# EAGLE design apollo18 (EAGLE 6.6.0)
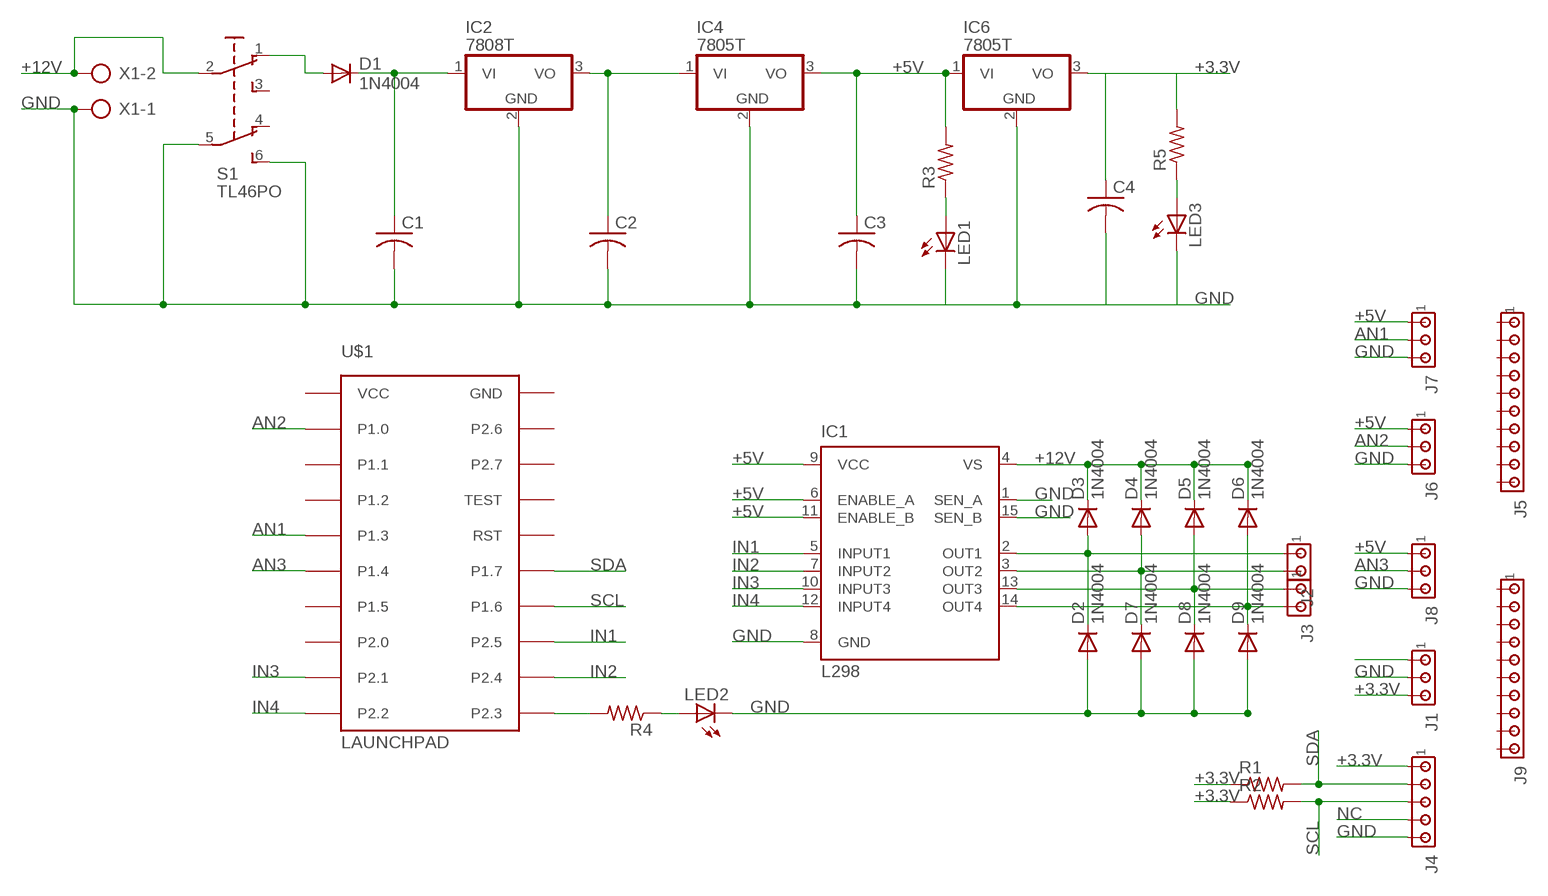
[diagram p0: schematic, sheet 1]

## Parts
C1  C-US025-050X050  [C025-050X050]
C2  C-US025-050X050  [C025-050X050]
C3  C-US025-050X050  [C025-050X050]
C4  C-US025-025X050  [C025-025X050]
D1  1N4004  [DO41-10]
D2  1N4004  [DO41-10]
D3  1N4004  [DO41-10]
D4  1N4004  [DO41-10]
D5  1N4004  [DO41-10]
D6  1N4004  [DO41-10]
D7  1N4004  [DO41-10]
D8  1N4004  [DO41-10]
D9  1N4004  [DO41-10]
IC1  L298  [MULTIWATT-15]
IC2  7808T  [TO220H]
IC4  7805T  [TO220H]
IC6  7805T  [TO220H]
J1  MTA03-100  [10X03MTA]
J2  MTA02-100  [10X02MTA]
J3  MTA02-100  [10X02MTA]
J4  MTA05-100  [10X05MTA]
J5  MTA10-100  [10X10MTA]
J6  MTA03-100  [10X03MTA]
J7  MTA03-100  [10X03MTA]
J8  MTA03-100  [10X03MTA]
J9  MTA10-100  [10X10MTA]
LED1  LED5MM  [LED5MM]
LED2  LED5MM  [LED5MM]
LED3  LED5MM  [LED5MM]
R1  R-US_0204/7  [0204/7]
R2  R-US_0204/7  [0204/7]
R3  R-US_0204/7  [0204/7]
R4  R-US_0204/7  [0204/7]
R5  R-US_0204/7  [0204/7]
S1  TL46PO  [TL4XPO]
U$1  LAUNCHPAD  [LAUNCHPAD]
X1  AK300/2  [AK300/2]

## Nets
+3.3V: C4.1 IC6.3(VO) J1.3 J4.1 R1.1 R2.1 R5.2
+5V: C3.1 IC1.6(ENABLE_A) IC1.9(VCC) IC1.11(ENABLE_B) IC4.3(VO) IC6.1(VI) J6.1 J7.1 J8.1 R3.2
+12V: D3.C D4.C D5.C D6.C IC1.4(VS) S1.2(P) X1.2
AN1: J7.2 U$1.P1.3
AN2: J6.2 U$1.P1.0
AN3: J8.2 U$1.P1.4
GND: C1.2 C2.2 C3.2 C4.2 D2.A D7.A D8.A D9.A IC1.1(SEN_A) IC1.8(GND) IC1.15(SEN_B) IC2.2(GND) IC4.2(GND) IC6.2(GND) J1.2 J4.5 J6.3 J7.3 J8.3 LED1.K(C) LED2.K(C) LED3.K(C) S1.5(P1) S1.6(S1) X1.1
IN1: IC1.5(INPUT1) U$1.P2.5
IN2: IC1.7(INPUT2) U$1.P2.4
IN3: IC1.10(INPUT3) U$1.P2.1
IN4: IC1.12(INPUT4) U$1.P2.2
N$1: J1.1
N$2: D2.C D3.A IC1.2(OUT1) J2.1
N$3: D4.A D7.C IC1.3(OUT2) J2.2
N$4: D5.A D8.C IC1.13(OUT3) J3.1
N$5: D6.A D9.C IC1.14(OUT4) J3.2
N$6: C1.1 D1.C IC2.1(VI)
N$7: D1.A S1.1(O)
N$8: C2.1 IC2.3(VO) IC4.1(VI)
N$9: LED3.A R5.1
N$11: LED1.A R3.1
N$12: R4.2 U$1.P2.3
N$13: LED2.A R4.1
NC: J4.4
SCL: J4.3 R2.2 U$1.P1.6
SDA: J4.2 R1.2 U$1.P1.7
Unconnected: J5.1 J5.2 J5.3 J5.4 J5.5 J5.6 J5.7 J5.8 J5.9 J5.10 J9.1 J9.2 J9.3 J9.4 J9.5 J9.6 J9.7 J9.8 J9.9 J9.10 S1.3(S) S1.4(O1) U$1.P1.1 U$1.P1.2 U$1.P1.5 U$1.P2.0 U$1.P2.6 U$1.P2.7 U$1.RST U$1.TEST

## Power pins joined to a net without a drawn wire
GND: U$1.GND
VCC: U$1.VCC

## Library data of the parts
C1-C4 = rcl:C-US: CAPACITOR, American symbol
D1-D9 = diode:1N4004: DIODE general purpose rectifier, 1 A
IC1 = st-microelectronics:L298: DUAL FULL-BRIDGE DRIVER; MPN: L298N; OC_FARNELL: 1589425; OC_NEWARK: 32M1527
IC2 IC4 IC6 = linear:78*: Positive VOLTAGE REGULATOR Source: http://cache.national.com/ds/LM/LM78L05.pdf http://www.fairchildsemi.com/ds/LM/LM7805.pdf
J1 J6-J8 = con-amp:MTA03-100: AMP connector
J2 J3 = con-amp:MTA02-100: AMP connector
J4 = con-amp:MTA05-100: AMP connector
J5 J9 = con-amp:MTA10-100: AMP connector
LED1-LED3 = led:LED: LED OSRAM: - CHIPLED LG R971, LG N971, LY N971, LG Q971, LY Q971, LO R971, LY R971 LH N974, LH R974 LS Q976, LO Q976, LY Q976 LO Q996 - Hyper CHIPLED LW Q18S LB Q993, LB Q99A, LB R99A - SideLED LS A670, LO A670, LY A670, LG A670, LP A670 LB A673, LV A673, LT A673, LW A673 LH A674 LY A675 LS A676, LA A676, LO A676, LY A676, LW A676 LS A679, LY A679, LG A679 - Hyper Micro SIDELED® LS Y876, LA Y876, LO Y876, LY Y876 LT Y87S - SmartLED LW L88C, LW L88S LB L89C, LB L89S, LG L890 LS L89K, LO L89K, LY L89K LS L896, LA L896, LO L896, LY L896 - TOPLED LS T670, LO T670, LY T670, LG T670, LP T670 LSG T670, LSP T670, LSY T670, LOP T670, LYG T670 LG T671, LOG T671, LSG T671 LB T673, LV T673, LT T673, LW T673 LH T674 LS T676, LA T676, LO T676, LY T676, LB T676, LH T676, LSB T676, LW T676 LB T67C, LV T67C, LT T67C, LS T67K, LO T67K, LY T67K, LW E67C LS E67B, LA E67B, LO E67B, LY E67B, LB E67C, LV E67C, LT E67C LW T67C LS T679, LY T679, LG T679 LS T770, LO T770, LY T770, LG T770, LP T770 LB T773, LV T773, LT T773, LW T773 LH T774 LS E675, LA E675, LY E675, LS T675 LS T776, LA T776, LO T776, LY T776, LB T776 LHGB T686 LT T68C, LB T68C - Hyper Mini TOPLED® LB M676 - Mini TOPLED Santana® LG M470 LS M47K, LO M47K, LY M47K Source: http://www.osram.convergy.de LUXEON: - LUMILED® LXK2-PW12-R00, LXK2-PW12-S00, LXK2-PW14-U00, LXK2-PW14-V00 LXK2-PM12-R00, LXK2-PM12-S00, LXK2-PM14-U00 LXK2-PE12-Q00, LXK2-PE12-R00, LXK2-PE12-S00, LXK2-PE14-T00, LXK2-PE14-U00 LXK2-PB12-K00, LXK2-PB12-L00, LXK2-PB12-M00, LXK2-PB14-N00, LXK2-PB14-P00, LXK2-PB14-Q00 LXK2-PR12-L00, LXK2-PR12-M00, LXK2-PR14-Q00, LXK2-PR14-R00 LXK2-PD12-Q00, LXK2-PD12-R00, LXK2-PD12-S00 LXK2-PH12-R00, LXK2-PH12-S00 LXK2-PL12-P00, LXK2-PL12-Q00, LXK2-PL12-R00 Source: www.luxeon.com KINGBRIGHT: KA-3528ASYC Source: www.kingbright.com
R1 R2 = adafruit:R-US_: RESISTOR, American symbol
R3-R5 = rcl:R-US_: RESISTOR, American symbol
S1 = switch:TL46PO: TINY SWITCH ON - ON Source: http://www2.produktinfo.conrad.com/datenblaetter/700000-724999/705152-da-01-de-Subminiaturschalter_TL_36YO.pdf
U$1 = TI_launchpad:LAUNCHPAD: MSP-EXP430G2 LaunchPad Booster Pack layouts. LAUNCHPAD: Full-size board LAUNCHPAD-50MM: 50x50mm board covering the button area LAUNCHPAD-50MM-LEFT: 50x50mm board leaving the button area open. Tall LaunchPad components marked on Reference for reference.
X1 = con-ptr500:AK300/2: CONNECTOR; OC_FARNELL: unknown; OC_NEWARK: unknown

## Board
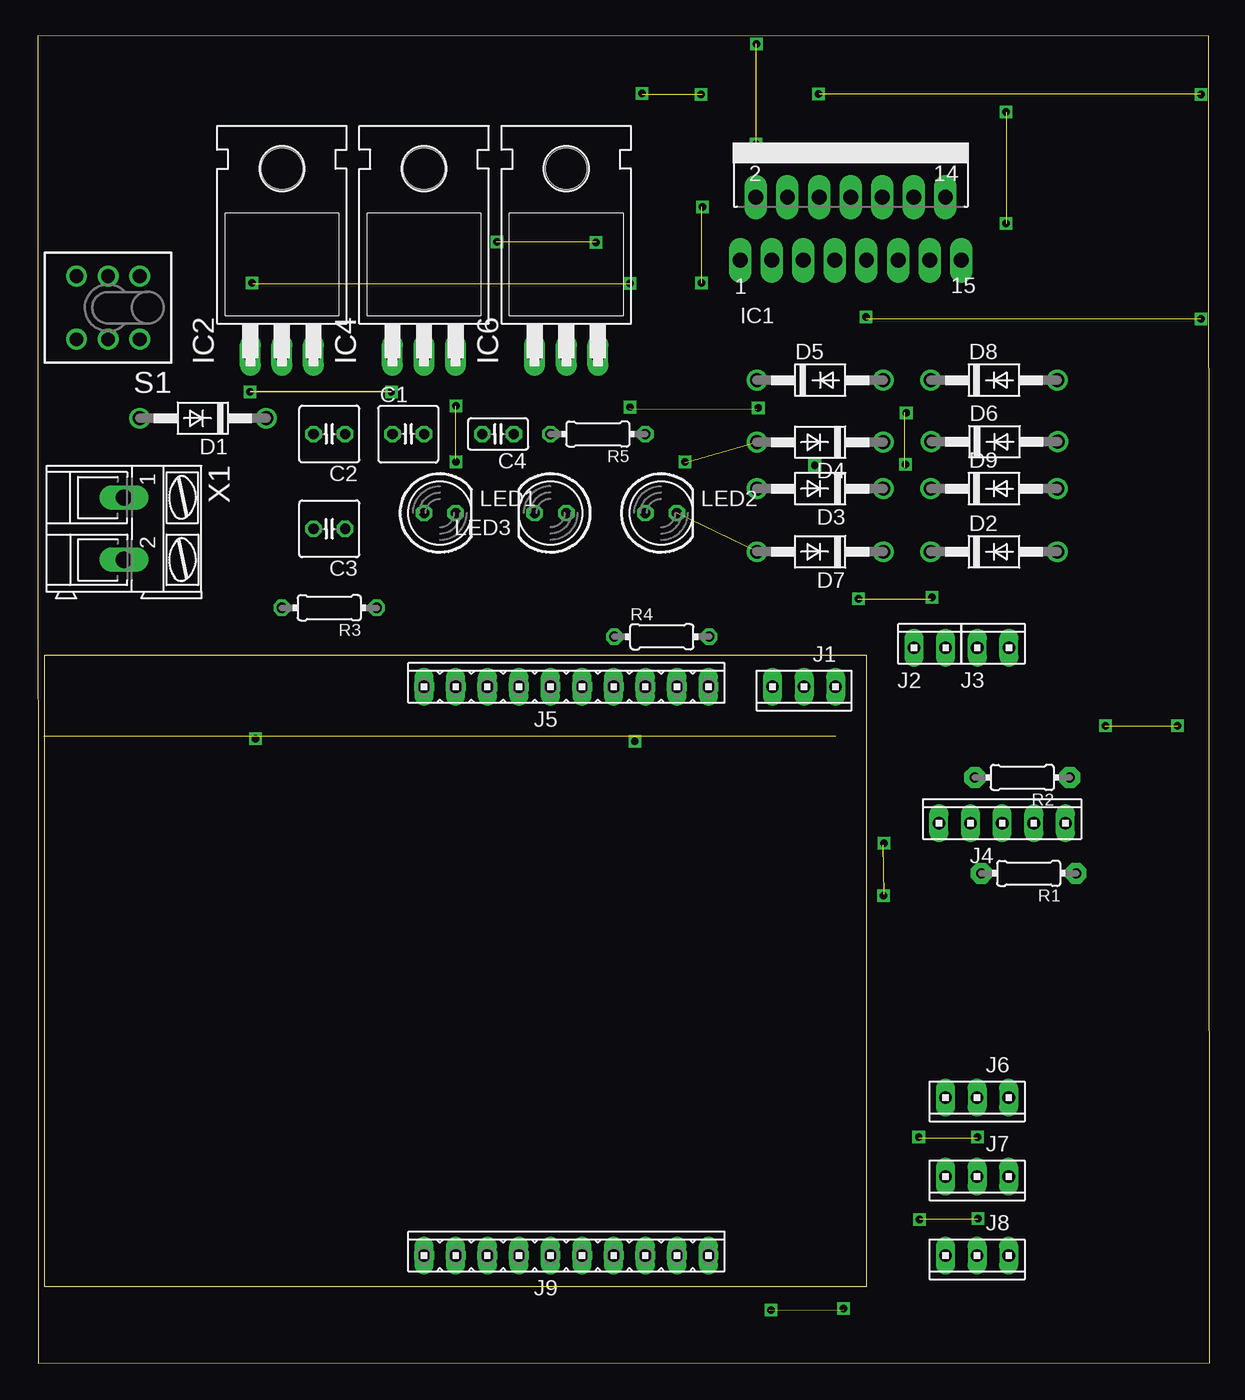
[diagram p1: board, top side]
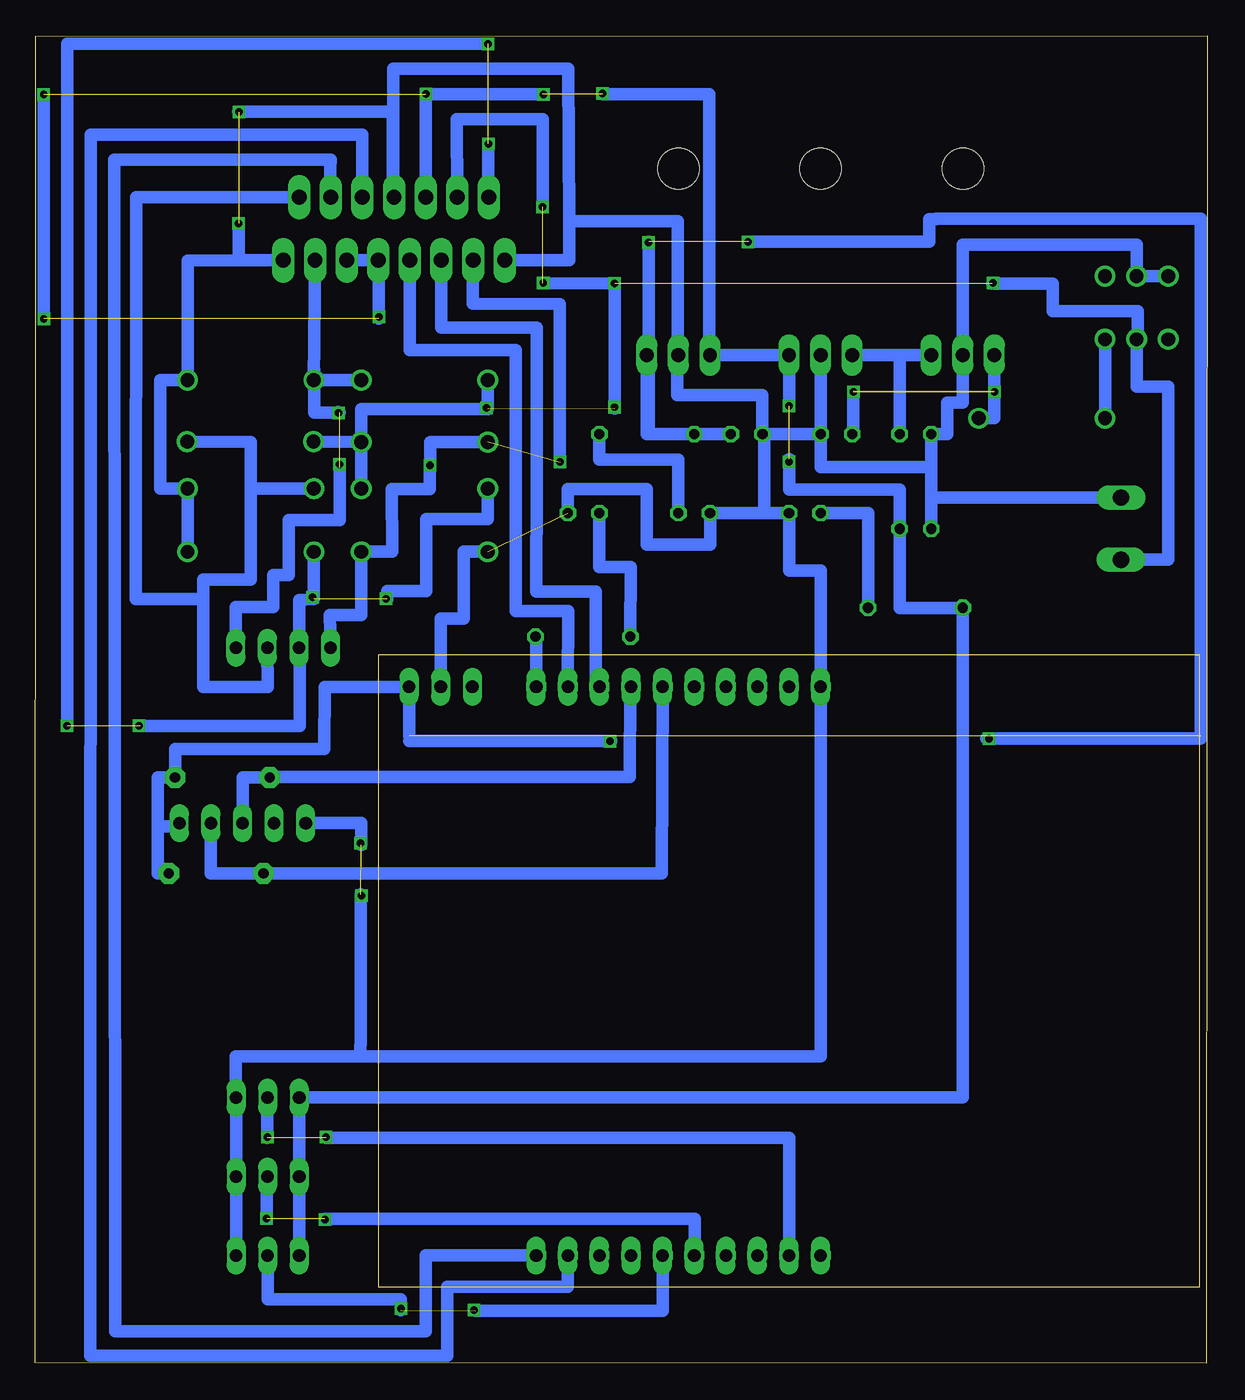
[diagram p2: board, bottom side, seen from below]

Size 94.2 x 106.74 mm. Coordinates in mm from the lower left corner, seen from the top.
Outline: 0.06,0 94.2,0.03 94.15,106.71 0,106.74 0.06,0
Copper layers (1*16): Top 0.035mm / dielectric 1.5mm / Bottom 0.035mm
Design rules "default *": minimum track width 40mil, minimum drill 24mil, track to track 40mil, track to pad 40mil, pad to pad 40mil, via to via 40mil, smd to smd 8mil, copper to edge 40mil, drill to drill 40mil, minimum pad ring 10mil, minimum via ring 8mil, stop-mask expansion 4mil, vias tented up to drill 0mil, thermal gap 10mil

### Footprints (pad centres in the part's own frame; a part is rotated, then mirrored left to right if it is on the bottom)
C025-050X050 = drill 0.813 octagon: 1 -1.27,0; 2 1.27,0
C025-025X050 = drill 0.813 octagon: 1 -1.27,0; 2 1.27,0
DO41-10 = drill 1.118: A 5.08,0; C -5.08,0
MULTIWATT-15 = drill 1.2 long: 1 -8.89,-7.62; 2 -7.62,-2.54; 3 -6.35,-7.62; 4 -5.08,-2.54; 5 -3.81,-7.62; 6 -2.54,-2.54; 7 -1.27,-7.62; 8 0,-2.54; 9 1.27,-7.62; 10 2.54,-2.54; 11 3.81,-7.62; 12 5.08,-2.54; 13 6.35,-7.62; 14 7.62,-2.54; 15 8.89,-7.62
TO220H = drill 1.118 long: 1 -2.54,-10.16; 2 0,-10.16; 3 2.54,-10.16 | hole 3.302: 0,4.826
10X03MTA = drill 1.016 long: 1 2.54,0; 2 0,0; 3 -2.54,0
10X02MTA = drill 1.016 long: 1 1.27,0; 2 -1.27,0
10X05MTA = drill 1.016 long: 1 5.08,0; 2 2.54,0; 3 0,0; 4 -2.54,0; 5 -5.08,0
10X10MTA = drill 1.016 long: 1 11.43,0; 2 8.89,0; 3 6.35,0; 4 3.81,0; 5 1.27,0; 6 -1.27,0; 7 -3.81,0; 8 -6.35,0; 9 -8.89,0; 10 -11.43,0
LED5MM = drill 0.813 octagon: A -1.27,0; K 1.27,0
0204/7 = drill 0.813 pad 1.676 octagon: 1 -3.81,0; 2 3.81,0
0204/7' = drill 0.813 octagon: 1 -3.81,0; 2 3.81,0
TL4XPO = drill 1.1 pad 1.676: 1 -2.54,2.54; 2 0,2.54; 3 2.54,2.54; 4 -2.54,-2.54; 5 0,-2.54; 6 2.54,-2.54
LAUNCHPAD = drill 0.914 pad 1.6 octagon: GND 30.48,48.26; P1.0 33.02,2.54; P1.1 35.56,2.54; P1.2 38.1,2.54; P1.3 40.64,2.54; P1.4 43.18,2.54; P1.5 45.72,2.54; P1.6 45.72,48.26; P1.7 43.18,48.26; P2.0 48.26,2.54; P2.1 50.8,2.54; P2.2 53.34,2.54; P2.3 53.34,48.26; P2.4 50.8,48.26; P2.5 48.26,48.26; P2.6 33.02,48.26; P2.7 35.56,48.26; RST 40.64,48.26; TEST 38.1,48.26; VCC 30.48,2.54
AK300/2 = drill 1.321 long: 1 -2.515,0; 2 2.489,0

### Placement (x,y rotation side)
C1  29.8,74.7 0 top
C2  23.45,74.7 180 top
C3  23.45,67.08 180 top
C4  37.01,74.7 180 top
D1  13.29,75.97 180 top
D2  76.87,65.24 0 top
D3  62.9,70.32 180 top
D4  62.9,74.05 180 top
D5  62.9,79.04 0 top
D6  76.91,74.08 0 top
D7  62.9,65.24 180 top
D8  76.87,79.04 0 top
D9  76.87,70.32 0 top
IC1  65.36,96.29 0 top
IC2  19.64,91.21 0 top
IC4  31.07,91.21 0 top
IC6  42.5,91.21 0 top
J1  61.6,54.38 180 top
J2  71.72,57.51 0 top
J3  76.8,57.53 0 top
J4  77.53,43.42 0 top
J5  42.5,54.38 0 top
J6  75.52,21.36 180 top
J7  75.52,15.01 180 top
J8  75.52,8.66 180 top
J9  42.5,8.66 0 top
LED1  32.34,68.35 0 top
LED2  50.12,68.35 0 top
LED3  41.23,68.35 180 top
R1  79.66,39.38 180 top
R2  79.15,47.09 180 top
R3  [0204/7']  23.45,60.73 180 top
R4  [0204/7']  50.17,58.41 0 top
R5  [0204/7']  45.04,74.7 180 top
S1  5.67,84.86 180 top
U$1  0.59,6.12 0 top
X1  6.94,67.08 270 top

### Tracks (layer width: path | path; a pad name or v marks a point on that pad's centre or on a via)
+3.3V  (2 unrouted)
  Bottom 1.016: 44.89,74.7 R5.2 C4.1 | IC6.3 45.04,74.7 44.89,74.7 | 84.33,43.15 84.33,47.09 R2.1 82.96,49.38 70.98,49.38 70.94,54.38 J1.3 64.14,50.43 | 84.33,43.15 82.61,43.15 J4.1 | R1.1 84.33,39.38 84.33,43.15 | 44.89,74.7 44.89,90.16 | 0.49,50.43 0.49,92.02 21.77,92.02 21.77,91.98 22.35,91.98 22.35,90.16 36.85,90.16 | 36.85,90.16
+5V  (4 unrouted)
  Bottom 1.016: J8.1 J7.1 J6.1 19.64,21.36 R3.2 24.72,60.73 C3.1 24.69,67.08 24.69,70.22 33.59,70.22 33.59,72.67 | IC1.6 62.82,102.03 53.43,102.03 | 48.51,102.09 48.59,102.03 40.01,102.03 40.01,81.05 IC6.1 IC4.3 33.59,76.93 | IC1.11 IC1.9 66.59,88.67 66.59,83.98 | 93.51,83.98 93.51,102.02
+12V  (3 unrouted)
  Bottom 1.016: X1.2 3.13,64.59 3.13,78.51 5.67,78.51 S1.2 5.58,82.32 5.58,84.57 12.39,84.57 12.39,86.82 17.28,86.82 | D4.C D3.C | D4.C D6.C | D5.C 57.82,76.73 67.98,76.73 D4.C | 47.61,76.76 47.62,78.57 47.62,86.82 53.39,86.84 | IC1.4 60.3,100.03 53.39,100.03 53.39,92.99
AN1  (1 unrouted)
  Bottom 1.016: U$1.P1.3 41.17,8.66 41.17,11.59 70.92,11.59 | J7.2 75.59,15.01 75.59,11.59
AN2  (1 unrouted)
  Bottom 1.016: J6.2 75.53,21.36 75.53,18.1 | U$1.P1.0 33.58,8.66 33.58,18.1 70.82,18.1
AN3  (1 unrouted)
  Bottom 1.016: J8.2 75.52,5.13 64.8,5.13 64.8,4.26 | U$1.P1.4 43.77,4.21 58.81,4.21 58.89,4.26
GND  (3 unrouted)
  Bottom 1.016: C3.2 22.18,69.6 | 22.18,69.6 22.18,72.06 | 22.18,72.06 C2.2 20.91,74.7 20.91,77.24 19.64,77.24 IC2.2 19.64,89.94 5.67,89.94 S1.5 S1.6 | X1.1 22.18,69.6 | IC4.2 C1.2 | C1.2 C4.2 | 35.58,68.35 LED1.K 33.61,63.74 31.04,63.74 31.04,54.38 U$1.GND 31.07,24.66 68.05,24.66 | 35.58,68.35 LED3.K 39.96,65.81 45.04,65.81 45.04,70.27 51.39,70.27 LED2.K | D2.A D9.A 84.14,70.32 84.14,79.04 D8.A 81.95,88.66 77.85,88.67 | J8.3 J7.3 J6.3 78.08,21.36 78.08,24.66 68.05,24.66 | IC1.15 77.85,88.67 | 42.53,81.05 42.59,81.05 42.59,77.84 35.74,77.84 C4.2 | IC6.2 42.53,81.05 | 42.53,81.05 42.56,91.82 51.28,91.82 | 56.47,88.69 IC1.1 56.47,88.69 51.28,88.69 51.28,91.82 | J4.5 67.98,43.42 67.98,41.67 | 68.05,24.66 68.05,25.53 68.04,25.61 68.04,37.67 | C1.2 31.05,72.06 22.18,72.06 | D7.A 59.76,65.24 59.76,59.87 61.6,59.87 J1.2 | C4.2 35.58,74.7 35.58,68.35 | 77.85,100.6 77.87,100.63 65.44,100.63 65.44,93.75 IC1.8 65.43,93.75 65.43,104.08 51.34,104.08 51.29,91.82 51.28,91.82 | 77.85,88.67 77.85,91.64
IN1
  Bottom 1.016: U$1.P2.5 49.14,54.38 49.14,62.05 53.93,62.05 53.87,71.13 53.89,71.17 53.89,83.25 61.55,83.25 IC1.5
IN2
  Bottom 1.016: U$1.P2.4 51.41,54.38 51.36,60.46 55.58,60.46 55.57,75.02 55.57,75.1 55.57,81.45 64.09,81.45 IC1.7
IN3
  Bottom 1.016: U$1.P2.1 51.39,6.12 61.07,6.12 61.07,0.59 89.77,0.59 89.73,98.76 67.9,98.76 IC1.10
IN4
  Bottom 1.016: U$1.P2.2 62.82,8.66 62.82,2.55 87.78,2.55 87.85,96.75 70.44,96.75 70.47,96.13 70.47,96 70.47,93.75 IC1.12
N$2  (3 unrouted)
  Bottom 1.016: D2.C 71.79,61.43 72.98,61.35 J2.1 72.95,58.19 72.95,51.23 85.76,51.23 | D3.A 57.81,67.86 62.76,67.86 62.76,62.1 65.91,62.1 65.91,61.43 | 57.77,106.09 91.63,106.09 91.63,51.23 | IC1.2 57.77,93.75 57.77,98.04
N$3  (1 unrouted)
  Bottom 1.016: J2.2 70.52,60.16 67.98,60.16 D7.C 67.98,65.25 65.51,65.26 65.53,70.27 62.47,70.27 62.45,74.05 D4.A | IC1.3 59.02,85.18 52.02,85.14 52.02,72.82 52.01,72.42
N$4  (1 unrouted)
  Bottom 1.016: J3.1 78.06,60.78 75.08,60.78 75.08,63.39 73.83,63.39 73.83,67.78 69.72,67.78 | IC1.13 D8.C | D5.A D8.C | D8.C 71.77,79.89 71.77,76.43 69.82,76.43 69.82,76.46 69.71,76.45 | 69.77,67.86 69.72,67.78 | 69.72,67.78 69.72,72.03
N$5
  Bottom 1.016: D9.C 76.87,70.32 | 76.87,70.32 76.87,72.35 76.87,74.07 D6.A | 76.87,70.32 76.89,63.01 80.68,63.01 | 80.68,63.01 80.7,54.38 75.52,54.38 J3.2 | IC1.14 86.08,93.75 86.11,61.43 80.68,61.43 80.68,63.01
N$6  (2 unrouted)
  Bottom 1.016: D1.C 17.1,75.97 | IC2.1 17.1,75.97 | C1.1 28.44,74.7 28.44,78.11 | 17.1,75.97 17.1,78.11
N$7
  Bottom 1.016: S1.1 D1.A
N$8
  Bottom 1.016: IC2.3 24.72,81.05 | 24.72,81.05 C2.1 | 24.72,81.05 IC4.1
N$9
  Bottom 1.016: R5.1 48.85,72.64 42.5,72.64 LED3.A
N$10
  Bottom 1.016: 0.49,50.22 17.74,50.22
N$11
  Bottom 1.016: LED1.A 27.26,68.35 R3.1
N$12
  Bottom 1.016: R4.2 53.93,58.41 U$1.P2.3
N$13
  Bottom 1.016: LED2.A 48.85,64 46.32,64 R4.1
N$14
  Bottom 1.016: 64.12,50.01 47.9,50.01
N$15  (via drill 0.6)
  other vias: 48.59,102.08
N$16  (via drill 0.6)
  other vias: 57.8,106.06
N$17  (via drill 0.6)
  other vias: 57.76,98.01
N$18  (via drill 0.6)
  other vias: 62.77,102.04
N$19  (via drill 0.6)
  other vias: 53.33,101.99
N$20  (via drill 0.6)
  other vias: 93.51,102
N$21  (via drill 0.6)
  other vias: 93.51,83.97
N$22  (via drill 0.6)
  other vias: 66.58,84.12
N$23  (via drill 0.6)
  other vias: 77.82,100.62
N$24  (via drill 0.6)
  other vias: 77.85,91.64
N$25  (via drill 0.6)
  other vias: 69.82,76.41
N$26  (via drill 0.6)
  other vias: 69.76,72.26
N$27  (via drill 0.6)
  other vias: 52.02,72.45
N$28  (via drill 0.6)
  other vias: 62.47,72.2
N$29  (via drill 0.6)
  other vias: 85.85,51.25
N$30  (via drill 0.6)
  other vias: 91.63,51.25
N$31  (via drill 0.6)
  other vias: 65.99,61.44
N$32  (via drill 0.6)
  other vias: 71.89,61.57
N$33  (via drill 0.6)
  other vias: 58.94,4.26
N$34  (via drill 0.6)
  other vias: 64.79,4.39
N$35  (via drill 0.6)
  other vias: 70.83,18.16
N$36  (via drill 0.6)
  other vias: 75.54,18.16
N$37  (via drill 0.6)
  other vias: 70.89,11.56
N$38  (via drill 0.6)
  other vias: 75.6,11.62
N$39  (via drill 0.6)
  other vias: 67.99,37.58
N$40  (via drill 0.6)
  other vias: 68.05,41.81
N$41  (via drill 0.6)
  other vias: 17.22,86.85
N$42  (via drill 0.6)
  other vias: 47.62,86.82
N$43  (via drill 0.6)
  other vias: 36.91,90.16
N$44  (via drill 0.6)
  other vias: 44.89,90.13
N$45  (via drill 0.6)
  other vias: 53.36,86.85
N$46  (via drill 0.6)
  other vias: 53.43,92.95
N$47  (via drill 0.6)
  other vias: 47.62,76.87
N$48  (via drill 0.6)
  other vias: 57.92,76.8
N$49  (via drill 0.6)
  other vias: 17.08,78.08
N$50  (via drill 0.6)
  other vias: 28.43,78.08
N$51  (via drill 0.6)
  other vias: 33.62,72.47
N$52  (via drill 0.6)
  other vias: 33.62,76.97
N$53  (via drill 0.6)
  other vias: 17.53,50.19
N$54  (via drill 0.6)
  other vias: 48,50.01
SCL
  Bottom 1.016: J4.3 77.53,47.09 R2.2 75.34,47.11 46.41,47.11 46.37,54.38 U$1.P1.6
SDA
  Bottom 1.016: J4.2 80.07,39.38 R1.2 43.84,39.38 U$1.P1.7